# Altium schematic sheet WZMACNIACZROZNICOWY.SchDoc
size A4
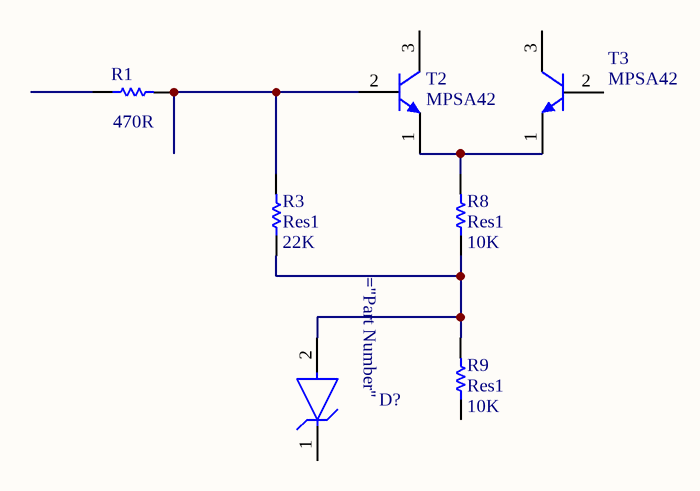
[diagram p0: WZMACNIACZROZNICOWY.SchDoc]

## Parts
D?  DFLZ15-7  (value not drawn)
R1  (no value)  [Vishay_CRCW1206_IPC_C]
R3  Res1  value 22K  [TE_CRGP0603_IPC_A]
R8  Res1  value 10K  [TE_Connectivity_CRGCQ1206_IPC_B]
R9  Res1  value 10K  [TE_Connectivity_CRGCQ1206_IPC_B]
T2  MPSA42  [ONSC-TO-92-3-29-11]
T3  MPSA42  [ONSC-TO-92-3-29-11]

## Nets
NetD?_2: D?.2(A) R3.1 R8.1 R9.2
NetR1_2: R1.2 R3.2 T2.2(B)
NetR8_2: R8.2 T2.1(E) T3.1(E)

Not connected (* = marked no-connect by the designer): D? 1(C); R1 1; R9 1; T2 3(C); T3 2(B) 3(C)

## Notes on the sheet
- (in symbol Res1) 470R

## Library data of the parts
R1 R3 R8 R9 = Res1: Resistor; Published: 8-Jun-2000; LatestRevisionDate: 17-Jul-2002; LatestRevisionNote: Re-released for DXP Platform.; PackageReference: AXIAL-0.3; Publisher: Altium Limited; PackageDescription: Axial Device, Thru-Hole; 2 Leads; 0.3 in Pin Spacing
T2 T3 = MPSA42: High Voltage Transistor, NPN Silicon, 3-Pin TO-92, Bulk Box; Manufacturer: On Semiconductor; Note1: 0; fT Min (MHz): 50; IC Continuous (A): 0.5; Polarity: NPN; ComponentLink1Description: Manufacturer URL; ComponentLink2Description: Datasheet; ComponentLink3Description: Package Specification; Mounting Technology: Through Hole; ComponentLink3URL: http://www.onsemi.cn/pub_link/Collateral/2N6426-D.PDF; DatasheetVersion: Rev. 8; ComponentLink1URL: http://www.onsemi.com/; Packing: Bulk Box; PackageVersion: Rev. AM; PartNumber: MPSA42; PackageReference: TO-92-3-29-11_AM_SL; PackageDescription: 3-Pin Transistor Outline, Body 4.825 x 3.685 mm, Pitch 1.27 mm; ComponentLink2URL: http://www.onsemi.cn/pub_link/Collateral/MPSA42-D.PDF; RoHS: FALSE